# EAGLE design FETishOnAStick (EAGLE 7.4.0)
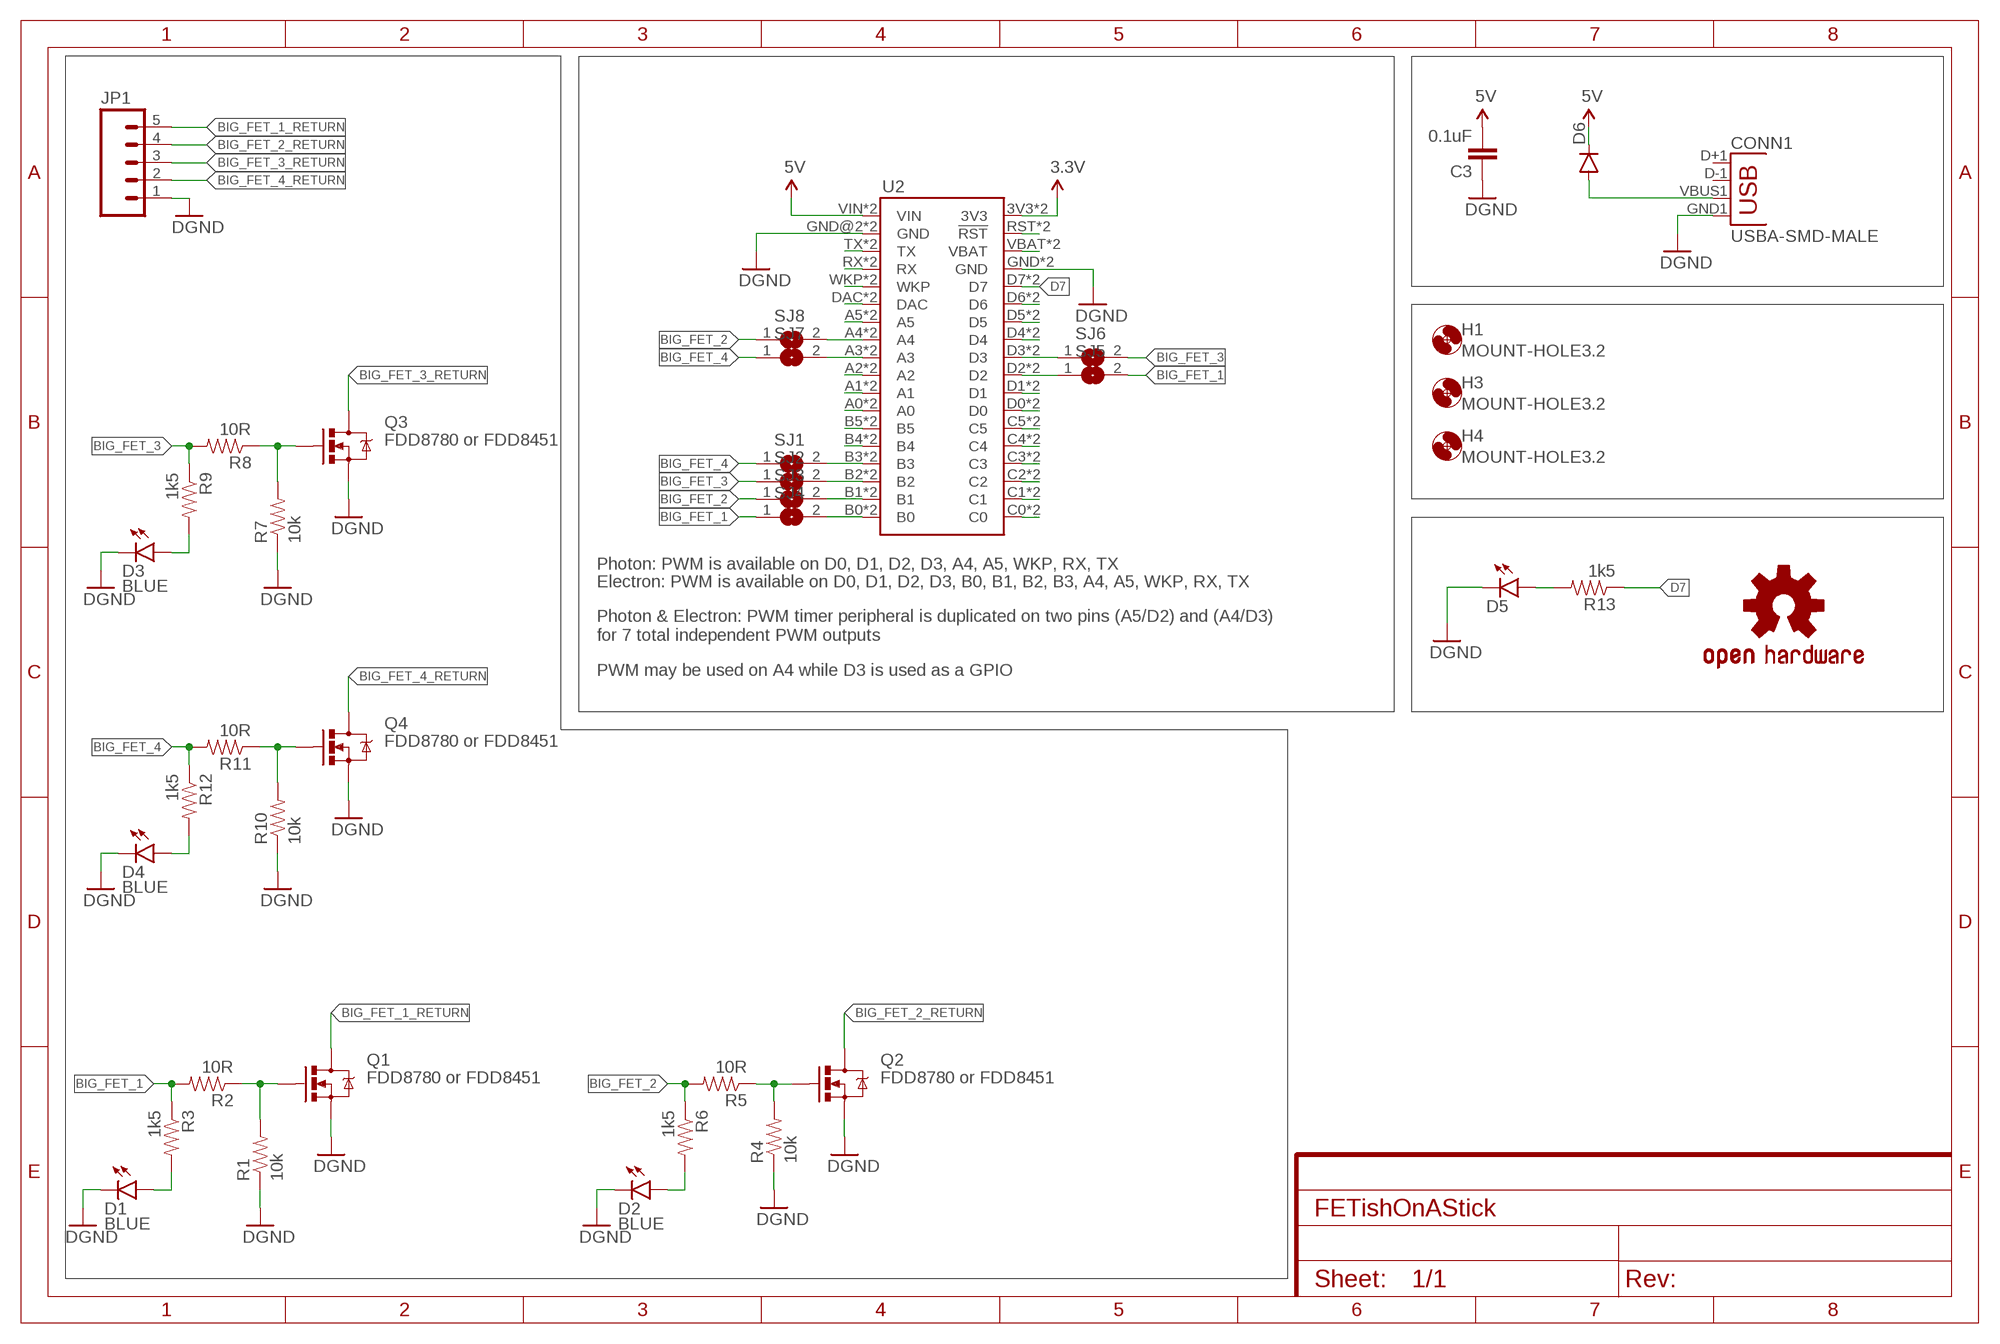
[diagram p0: schematic, sheet 1]

## Parts
C3  0.1uF  CAP0805  [0805]
CONN1  USBA-SMD-MALE  [USB-A-SMT-MALE]
D1  BLUE  LED-BLUE1206  [LED-1206]
D2  BLUE  LED-BLUE1206  [LED-1206]
D3  BLUE  LED-BLUE1206  [LED-1206]
D4  BLUE  LED-BLUE1206  [LED-1206]
D5  LED1206-BOTTOM  [LED-1206-BOTTOM]
D6  DIODESMA  [SMA-DIODE]
H1  MOUNT-HOLE3.2  [3,2]
H3  MOUNT-HOLE3.2  [3,2]
H4  MOUNT-HOLE3.2  [3,2]
JP1  M05SCREW  [SCREWTERMINAL-3.5MM-5]
LOGO1  OSHW-LOGOM  [OSHW-LOGO-M]
Q1  FDD8780 or FDD8451  MOSFET-NCHANNELFDD8780  [DPAK]
Q2  FDD8780 or FDD8451  MOSFET-NCHANNELFDD8780  [DPAK]
Q3  FDD8780 or FDD8451  MOSFET-NCHANNELFDD8780  [DPAK]
Q4  FDD8780 or FDD8451  MOSFET-NCHANNELFDD8780  [DPAK]
R1  10k  RESISTOR0805-RES  [0805]
R2  10R  RESISTOR0805-RES  [0805]
R3  1k5  RESISTOR0805-RES  [0805]
R4  10k  RESISTOR0805-RES  [0805]
R5  10R  RESISTOR0805-RES  [0805]
R6  1k5  RESISTOR0805-RES  [0805]
R7  10k  RESISTOR0805-RES  [0805]
R8  10R  RESISTOR0805-RES  [0805]
R9  1k5  RESISTOR0805-RES  [0805]
R10  10k  RESISTOR0805-RES  [0805]
R11  10R  RESISTOR0805-RES  [0805]
R12  1k5  RESISTOR0805-RES  [0805]
R13  1k5  RESISTOR0805-RES  [0805]
SJ1  SJ  [SJ]
SJ2  SJ  [SJ]
SJ3  SJ  [SJ]
SJ4  SJ  [SJ]
SJ5  SJ  [SJ]
SJ6  SJ  [SJ]
SJ7  SJ  [SJ]
SJ8  SJ  [SJ]
U2  ELECTRONDUALNAMED  [ELECTRON_SIMPLE_SILK_NAMES_DUAL]

## Nets
3.3V: U2.3V3 U2.3V3_1(3V3)
5V: C3.2 D6.C U2.VIN U2.VIN_1B(VIN)
BIG_FET_1: R2.2 R3.1 SJ4.1 SJ5.2
BIG_FET_1_RETURN: JP1.5 Q1.4(D)
BIG_FET_2: R5.2 R6.1 SJ3.1 SJ8.1
BIG_FET_2_RETURN: JP1.4 Q2.4(D)
BIG_FET_3: R8.2 R9.1 SJ2.1 SJ6.2
BIG_FET_3_RETURN: JP1.3 Q3.4(D)
BIG_FET_4: R11.2 R12.1 SJ1.1 SJ7.1
BIG_FET_4_RETURN: JP1.2 Q4.4(D)
D7: R13.1 U2.D7 U2.D7_1(D7)
GND: C3.1 CONN1.GND1(GND) D1.C D2.C D3.C D4.C D5.C JP1.1 Q1.3(S) Q2.3(S) Q3.3(S) Q4.3(S) R1.1 R4.1 R7.1 R10.1 U2.GND U2.GND@2(GND) U2.GND_1(GND) U2.GND_1B(GND) ; supply symbol labelled DGND
N$1: CONN1.VBUS1(VBUS) D6.A
N$4: Q4.1(G) R10.2 R11.1
N$6: U2.VBAT U2.VBATT_1(VBAT)
N$7: U2.RST(!RST) U2.RST_1(!RST)
N$11: D1.A R3.2
N$12: D2.A R6.2
N$13: D4.A R12.2
N$15: U2.D6 U2.D6_1(D6)
N$16: U2.D5 U2.D5_1(D5)
N$19: D5.A R13.2
N$20: U2.D4 U2.D4_1(D4)
N$21: Q3.1(G) R7.2 R8.1
N$22: D3.A R9.2
N$23: U2.C5 U2.C5_1(C5)
N$24: U2.C4 U2.C4_1(C4)
N$25: U2.C3 U2.C3_1(C3)
N$26: U2.C2 U2.C2_1(C2)
N$27: Q1.1(G) R1.2 R2.1
N$28: U2.C1 U2.C1_1(C1)
N$29: U2.C0 U2.C0_1(C0)
N$30: SJ8.2 U2.A4 U2.A4_1(A4)
N$31: SJ4.2 U2.B0 U2.B0_1(B0)
N$33: SJ3.2 U2.B1 U2.B1_1(B1)
N$35: SJ2.2 U2.B2 U2.B2_1(B2)
N$36: SJ1.2 U2.B3 U2.B3_1(B3)
N$37: U2.B4 U2.B4_1(B4)
N$38: U2.B5 U2.B5_1(B5)
N$39: U2.A0 U2.A0_1(A0)
N$40: U2.A1 U2.A1_1(A1)
N$41: U2.A2 U2.A2_1(A2)
N$42: SJ7.2 U2.A3 U2.A3_1(A3)
N$43: SJ6.1 U2.D3 U2.D3_1(D3)
N$44: U2.A5 U2.A5_1(A5)
N$45: U2.DAC U2.DAC_1(DAC)
N$46: U2.WKP U2.WKP_1(WKP)
N$47: U2.RX U2.RX_1(RX)
N$48: U2.TX U2.TX_1(TX)
N$49: SJ5.1 U2.D2 U2.D2_1(D2)
N$105: Q2.1(G) R4.2 R5.1
SCL: U2.D1 U2.D1_1(D1)
SDA: U2.D0 U2.D0_1(D0)
Unconnected: CONN1.D+1(D+) CONN1.D-1(D-)

## Notes on the sheet
- Photon: PWM is available on D0, D1, D2, D3, A4, A5, WKP, RX, TX
- Electron: PWM is available on D0, D1, D2, D3, B0, B1, B2, B3, A4, A5, WKP, RX, TX
- Photon & Electron: PWM timer peripheral is duplicated on two pins (A5/D2) and (A4/D3) 
  for 7 total independent PWM outputs
- PWM may be used on A4 while D3 is used as a GPIO

## Library data of the parts
C3 = SparkFun-Passives:CAP: Capacitor Standard 0603 ceramic capacitor, and 0.1" leaded capacitor.
CONN1 = SparkFun-Connectors:USB: USB Connectors USB-B-PTH is fully proven SKU : PRT-00139/CONN-08278 USB-miniB is fully proven SKU : PRT-00587 USB-A-PCB is untested. USB-A-H is throughly reviewed, but untested. Spark Fun Electronics SKU : PRT-00437 USB-B-SMT is throughly reviewed, but untested. Needs silkscreen touching up. USB-A-S has not been used/tested USB-MB-H has not been used/tested USB-MICROB has been used. CONN-09505
D1-D4 = SparkFun-LED:LED-BLUE: Blue LEDs for production use Various blue LEDs stocked by SparkFun production 0603 - DIO-08575 Rebel - DIO-09553 1206 - DIO-09911; PROD_ID: DIO-09911
D5 = SparkFun-LED:LED: LEDs Standard schematic elements and footprints for 5mm, 3mm, 1206, and 0603 sized LEDs. 5mm - Spark Fun Electronics SKU : COM-00529 (and others)
D6 = SparkFun-DiscreteSemi:DIODE: Diode These are standard reverse protection diodes and small signal diodes. SMA package can handle up to about 1A. SOD-323 can handle about 200mA. What the SOD-323 package when ordering, there are some mfgs out there that are 5-pin packages.
H1 H3 H4 = holes:MOUNT-HOLE: MOUNTING HOLE with drill center marker
JP1 = SparkFun-Connectors:M05: Header 5 Standard 5-pin 0.1" header. Use with straight break away headers (SKU : PRT-00116), right angle break away headers (PRT-00553), swiss pins (PRT-00743), machine pins (PRT-00117), and female headers (PRT-00115). Molex polarized connector foot print use with SKU : PRT-08230 with associated crimp pins and housings.; PROD_ID: Combine 8288+8399
LOGO1 = SparkFun-Aesthetics:OSHW-LOGO: Open Source Hardware Logo This logo indicates the piece of hardware it is found on incorporates a OSHW license and/or adheres to the definition of open source hardware found here: http://freedomdefined.org/OSHW
Q1-Q4 = SparkFun-DiscreteSemi:MOSFET-NCHANNEL: Common NMOSFET Parts MFG P/N Store ID Prod ID FDD8780 TRANS-09984 SI7820DN TRANS-11055 FDS6630A IC-08089 2N7002PW TRANS-11151 FQP30N06L COM-10213 TRANS-10060 BSS123LT1G TRANS-08345 BSS138 TRANS-00830 BS170 2N7000; PROD_ID: TRANS-09984
R1-R13 = SparkFun-Resistors:RESISTOR: Resistor Basic schematic elements and footprints for 0603, 1206, and PTH resistors.
SJ1-SJ8 = jumper:SJ: SMD solder JUMPER
U2 = Tinamous:ELECTRON

## Board
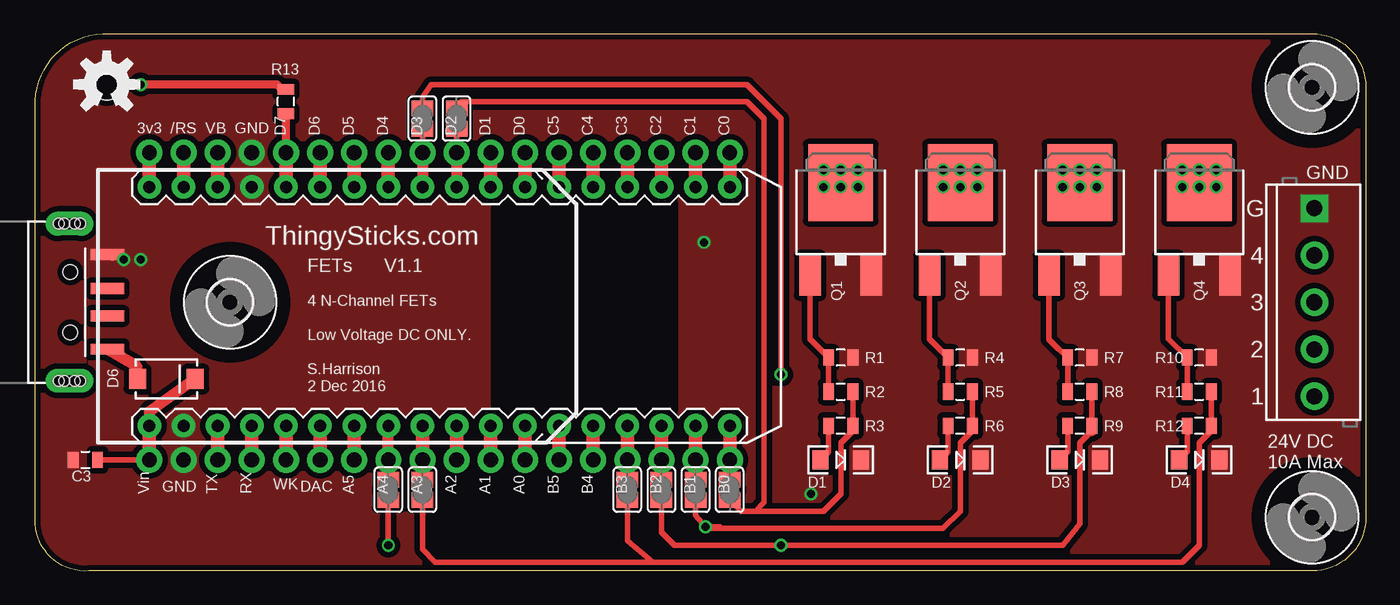
[diagram p1: board, top side]
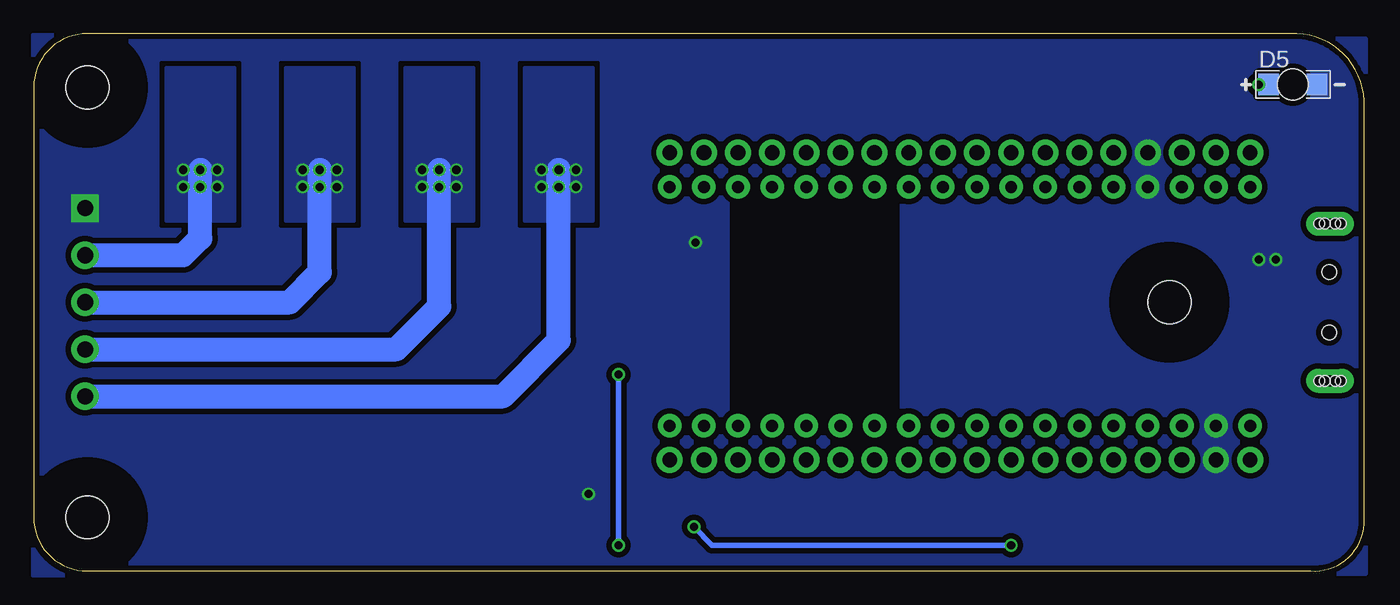
[diagram p2: board, bottom side, seen from below]

Size 99 x 40.01 mm. Coordinates in mm from the lower left corner, seen from the top.
Outline: 5.5,40.01 95,40.01 arc-90 99,36.01 99,4.01 arc-90 95,0.01 4,0.01 arc-90 0,3.51 0,35.01 arc-90 5.5,40.01
Copper layers (1*16): Top 0.0356mm / dielectric 1.5011mm / Bottom 0.0356mm
Design rules "OSHPark": minimum track width 6mil, minimum drill 13mil, track to track 6mil, track to pad 6mil, pad to pad 6mil, via to via 6mil, smd to smd 6mil, copper to edge 15mil, drill to drill 6mil, minimum pad ring 7mil, minimum via ring 7mil, stop-mask expansion 3mil, vias tented up to drill 0mil, thermal gap 10mil
tRestrict: area 34.5,9.5 to 47.2,29.9
bRestrict: area 35.2,9.5 to 46.6,29.9

### Footprints (pad centres in the part's own frame; a part is rotated, then mirrored left to right if it is on the bottom)
0805 = smd 0.8 x 1.2: 1 -0.9,0; 2 0.9,0
USB-A-SMT-MALE = smd 0.8 x 2.5: D+1 1.027,-5.87; D-1 -1.027,-5.87; GND1 3.551,-5.87; VBUS1 -3.5,-5.87 | drill 0.8 pad 1.778 long: P$1 5.85,-3.05; P$3 -5.85,-3.05 | hole 1.1: 2.25,-3.12; -2.25,-3.12 | hole 0.8: -5.85,-3.45; -5.85,-3.85; -5.85,-2.65; -5.85,-2.25; 5.85,-3.45; 5.85,-3.85; 5.85,-2.65; 5.85,-2.25
LED-1206 = smd 1.2 x 1.4: A -1.5,0; C 1.5,0
LED-1206-BOTTOM = smd 1.5 x 1.6: A -1.8,0; C 1.8,0 | hole 2.3: 0,0
SMA-DIODE = smd 1.27 x 1.47: A -2.15,0; C 2.15,0
3,2 = hole 3.2: 0,0
SCREWTERMINAL-3.5MM-5 = drill 1.2 pad 2.032 square: 1 0,0 | drill 1.2 pad 2.032: 2 3.5,0; 3 7,0; 4 10.5,0; 5 14,0
DPAK = smd 1.6 x 3: 1 -2.28,-5.31; 3 2.28,-5.31 | smd 4.826 x 5.715: 4 0,1.588
SJ = smd 1.168 x 1.6: 1 -0.762,0; 2 0.762,0
ELECTRON_SIMPLE_SILK_NAMES_DUAL = drill 0.889 pad 1.753: 3V3 1.27,22.86; A0 29.21,5.08; A1 26.67,5.08; A2 24.13,5.08; A3 21.59,5.08; A4 19.05,5.08; A5 16.51,5.08; B0 44.45,5.08; B1 41.91,5.08; B2 39.37,5.08; B3 36.83,5.08; B4 34.29,5.08; B5 31.75,5.08; C0 44.45,22.86; C1 41.91,22.86; C2 39.37,22.86; C3 36.83,22.86; C4 34.29,22.86; C5 31.75,22.86; D0 29.21,22.86; D1 26.67,22.86; D2 24.13,22.86; D3 21.59,22.86; D4 19.05,22.86; D5 16.51,22.86; D6 13.97,22.86; D7 11.43,22.86; DAC 13.97,5.08; GND 8.89,22.86; GND@2 3.81,5.08; RST 3.81,22.86; RX 8.89,5.08; TX 6.35,5.08; VBAT 6.35,22.86; VIN 1.27,5.08; WKP 11.43,5.08 | drill 1.1 pad 1.93: 3V3_1 1.27,25.4; A0_1 29.21,2.54; A1_1 26.67,2.54; A2_1 24.13,2.54; A3_1 21.59,2.54; A4_1 19.05,2.54; A5_1 16.51,2.54; B0_1 44.45,2.54; B1_1 41.91,2.54; B2_1 39.37,2.54; B3_1 36.83,2.54; B4_1 34.29,2.54; B5_1 31.75,2.54; C0_1 44.45,25.4; C1_1 41.91,25.4; C2_1 39.37,25.4; C3_1 36.83,25.4; C4_1 34.29,25.4; C5_1 31.75,25.4; D0_1 29.21,25.4; D1_1 26.67,25.4; D2_1 24.13,25.4; D3_1 21.59,25.4; D4_1 19.05,25.4; D5_1 16.51,25.4; D6_1 13.97,25.4; D7_1 11.43,25.4; DAC_1 13.97,2.54; GND_1 8.89,25.4; GND_1B 3.81,2.54; RST_1 3.81,25.4; RX_1 8.89,2.54; TX_1 6.35,2.54; VBATT_1 6.35,25.4; VIN_1B 1.27,2.54; WKP_1 11.43,2.54

### Placement (x,y rotation side)
C3  3.73,8.28 0 top
CONN1  -0.5,20.01 90 top
D1  59.93,8.28 0 top
D2  68.82,8.28 0 top
D3  77.71,8.28 0 top
D4  86.6,8.28 0 top
D5  5.32,36.22 0 bottom
D6  9.77,14.31 0 top
H1  14.5,20.01 0 top
H3  95,4.01 0 top
H4  95,36.01 0 top
JP1  95.17,27.01 270 top
LOGO1  5.32,36.22 0 top
Q1  59.93,27.33 0 top
Q2  68.82,27.33 0 top
Q3  77.71,27.33 0 top
Q4  86.6,27.33 0 top
R1  59.93,15.9 180 top
R2  59.93,13.36 0 top
R3  59.93,10.82 180 top
R4  68.82,15.9 180 top
R5  68.82,13.36 0 top
R6  68.82,10.82 180 top
R7  77.71,15.9 180 top
R8  77.71,13.36 0 top
R9  77.71,10.82 180 top
R10  86.6,15.9 180 top
R11  86.6,13.36 0 top
R12  86.6,10.82 180 top
R13  18.66,34.95 90 top
SJ1  44.05,6.05 90 top
SJ2  46.59,6.05 90 top
SJ3  49.14,6.05 90 top
SJ4  51.67,6.05 90 top
SJ5  31.35,33.68 90 top
SJ6  28.81,33.68 90 top
SJ7  28.81,6.05 90 top
SJ8  26.27,6.05 90 top
U2  7.23,5.74 0 top

### Tracks (layer width: path | path; a pad name or v marks a point on that pad's centre or on a via)
3.3V
  Top 1.016: U2.3V3 U2.3V3_1
5V
  Top 0.406: C3.2 U2.VIN_1B
  Top 0.813: U2.VIN 8.5,11.84 D6.C
  Top 1.016: U2.VIN_1B U2.VIN
BIG_FET_1
  Top 0.406: 60.83,12.99 R2.2 R3.1 60.83,10.45 59.93,9.55 59.93,5.74 58.66,4.47 53.58,4.47 | SJ5.2 31.67,34.95 52.94,34.95 54.22,33.68 54.22,5.1 53.58,4.47 | 53.58,4.47 52.5,4.47 SJ4.1
BIG_FET_1_RETURN  (via drill 0.6)
  Top 1.778: v59.93,29.87 Q1.4
  Bottom 1.778: JP1.5 64.09,13.01 59.93,17.17 v59.93,29.87
  other vias: 58.66,28.6 59.93,28.6 61.2,28.6 61.2,29.87 58.66,29.87
  pour Bottom: 57.39,26.06 62.47,26.06 62.47,37.49 57.39,37.49
BIG_FET_2  (via drill 0.6)
  Top 0.406: R5.2 R6.1 69.72,10.45 68.82,9.55 68.82,4.47 67.55,3.2 51.04,3.2 | 51.04,3.2 49.96,3.2 v49.88,3.29 | v49.88,3.29 49.14,4.15 SJ3.1 | SJ8.1 v26.27,1.93 | v49.88,3.29 50.95,3.29 51.04,3.2
  Bottom 0.406: v26.27,1.93 48.52,1.93 v49.88,3.29
BIG_FET_2_RETURN  (via drill 0.6)
  Top 1.778: Q2.4 | v68.82,28.6 Q2.4 | v68.82,29.87 Q2.4
  Bottom 1.778: JP1.4 72.02,16.51 68.82,19.71 v68.82,29.87
  other vias: 67.55,29.87 70.09,29.87 67.55,28.6 70.09,28.6
  pour Bottom: 66.28,26.06 71.36,26.06 71.36,37.49 66.28,37.49
BIG_FET_3  (via drill 0.6)
  Top 0.406: R8.2 R9.1 | 78.61,10.45 77.71,9.55 77.71,3.51 76.44,1.93 v55.48,1.93 47.55,1.93 46.59,2.88 SJ2.1 | SJ6.2 28.81,35.27 29.45,36.22 52.94,36.22 55.48,33.68 v55.48,14.63
  Top 0.813: R9.1 78.61,10.45
  Bottom 0.406: v55.48,14.63 v55.48,1.93
BIG_FET_3_RETURN  (via drill 0.6)
  Top 1.778: v77.71,29.87 Q3.4
  Bottom 1.778: JP1.3 79.95,20.01 77.71,22.25 v77.71,29.87
  other vias: 78.98,29.87 78.98,28.6 76.44,28.6 76.44,29.87 77.71,28.6
  pour Bottom: 75.17,26.06 80.25,26.06 80.25,37.49 75.17,37.49
BIG_FET_4
  Top 0.406: R11.2 R12.1 87.5,10.45 86.6,9.55 86.6,1.93 85.33,0.66 45.96,0.66 | SJ7.1 28.81,1.61 29.77,0.66 45.96,0.66 | 45.96,0.66 44.05,2.24 SJ1.1
BIG_FET_4_RETURN  (via drill 0.6)
  Top 1.778: v86.6,29.87 Q4.4
  Bottom 1.778: JP1.2 87.88,23.51 86.6,24.79 v86.6,29.87
  other vias: 85.33,29.87 87.87,29.87 85.33,28.6 85.33,28.6 87.87,28.6 86.6,28.6
  pour Bottom: 84.06,26.06 89.14,26.06 89.14,37.49 84.06,37.49
D7
  Top 0.61: U2.D7_1 R13.1
  Top 1.016: U2.D7 U2.D7_1
GND  (via drill 0.6)
  Top 0.813: 5.73,23.52 CONN1.GND1
  other vias: 6.59,23.2 7.86,23.2 49.77,24.47 57.71,5.74
  pour Bottom (isolate 0.406, rank 6, no thermals): -0.08,39.58 98.98,39.9 98.98,-0.3 -0.08,-0.17
  pour Top (isolate 0.406, rank 6, no thermals): -0.08,39.71 98.98,40.03 98.98,-0.3 -0.08,-0.3
N$1
  Top 0.813: CONN1.VBUS1 5.95,16.21 7.54,15.26 D6.A
N$4
  Top 0.406: Q4.1 84.32,17.28 R10.2 R11.1
N$6
  Top 1.016: U2.VBAT U2.VBATT_1
N$7
  Top 1.016: U2.RST U2.RST_1
N$11
  Top 0.406: R3.2 59.03,8.88 D1.A
N$12
  Top 0.406: R6.2 67.92,8.88 D2.A
N$13
  Top 0.406: R12.2 85.7,8.88 D4.A
N$15
  Top 1.016: U2.D6 U2.D6_1
N$16
  Top 1.016: U2.D5 U2.D5_1
N$19  (via drill 0.6)
  Top 0.61: R13.2 18.39,35.85 18.02,36.22 v7.86,36.22
  Bottom 0.61: v7.86,36.22 D5.A
N$20
  Top 1.016: U2.D4 U2.D4_1
N$21
  Top 0.406: Q3.1 75.43,17.22 76.12,16.53 76.17,16.53 R7.2 R8.1
N$22
  Top 0.406: R9.2 76.81,8.88 D3.A
N$23
  Top 1.016: U2.C5_1 U2.C5
N$24
  Top 1.016: U2.C4_1 U2.C4
N$25
  Top 1.016: U2.C3_1 U2.C3
N$26
  Top 1.016: U2.C2_1 U2.C2
N$27
  Top 0.406: Q1.1 57.65,17.28 R1.2 R2.1
N$28
  Top 1.016: U2.C1_1 U2.C1
N$29
  Top 1.016: U2.C0_1 U2.C0
N$30
  Top 0.406: SJ8.2 U2.A4_1
  Top 0.813: U2.A4_1 U2.A4
N$31
  Top 0.406: SJ4.2 U2.B0_1
  Top 1.016: U2.B0_1 U2.B0
N$33
  Top 0.406: SJ3.2 U2.B1_1
  Top 1.016: U2.B1 U2.B1_1
N$35
  Top 0.406: SJ2.2 U2.B2_1
  Top 1.016: U2.B2_1 U2.B2
N$36
  Top 0.406: SJ1.2 U2.B3_1
  Top 1.016: U2.B3 U2.B3_1
N$37
  Top 1.016: U2.B4_1 U2.B4
N$38
  Top 1.016: U2.B5 U2.B5_1
N$39
  Top 1.016: U2.A0_1 U2.A0
N$40
  Top 1.016: U2.A1 U2.A1_1
N$41
  Top 1.016: U2.A2_1 U2.A2
N$42
  Top 0.406: SJ7.2 U2.A3_1
  Top 1.016: U2.A3 U2.A3_1
N$43
  Top 0.406: SJ6.1 U2.D3_1
  Top 0.813: U2.D3_1 U2.D3
N$44
  Top 1.016: U2.A5 U2.A5_1
N$45
  Top 1.016: U2.DAC_1 U2.DAC
N$46
  Top 1.016: U2.WKP U2.WKP_1
N$47
  Top 1.016: U2.RX_1 U2.RX
N$48
  Top 1.016: U2.TX U2.TX_1
N$49
  Top 0.406: SJ5.1 U2.D2_1
  Top 0.813: U2.D2_1 U2.D2
N$50
  pour Bottom: 57.39,26.06 62.47,26.06 62.47,37.49 57.39,37.49
N$105
  Top 0.406: Q2.1 66.54,17.28 R4.2 R5.1
SCL
  Top 1.016: U2.D1 U2.D1_1
SDA
  Top 1.016: U2.D0_1 U2.D0

### Text on the board
tNames: GND | G | ThingySticks.com | 4 | FETs | V1.1 | 4 N-Channel FETs | 3 | Low Voltage DC ONLY. | 2 | S.Harrison | 2 Dec 2016 | 1 | 24V DC / 10A Max